# Altium schematic sheet DACs.SchDoc
size A; SheetNumber: 7; SheetTotal: 9
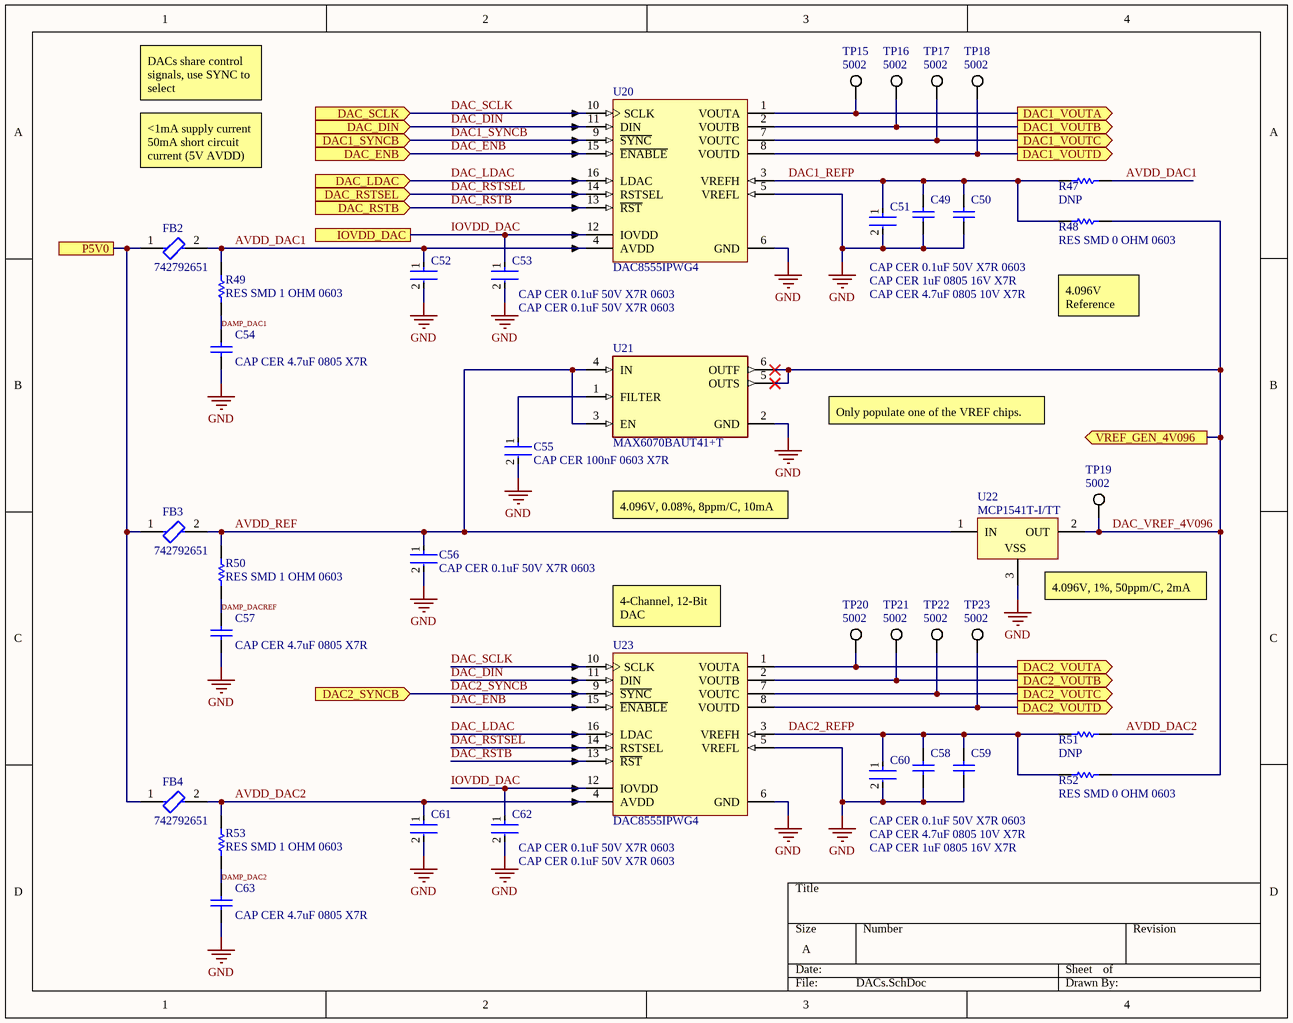
[diagram p0: DACs.SchDoc]

## Parts
C49  CAP CER 1uF 0805 16V X7R  [CAPC2013X140X50NL20T25]
C50  CAP CER 4.7uF 0805 10V X7R  [CAPC2013X140X50NL20T25]
C51  CAP CER 0.1uF 50V X7R 0603  [FP-CC0603-DA-MFG]
C52  CAP CER 0.1uF 50V X7R 0603  [FP-CC0603-DA-MFG]
C53  CAP CER 0.1uF 50V X7R 0603  [FP-CC0603-DA-MFG]
C54  CAP CER 4.7uF 0805 X7R  [CAPC2013X140X50NL20T25]
C55  CAP CER 100nF 0603 X7R  [FP-CC0603-DA-MFG]
C56  CAP CER 0.1uF 50V X7R 0603  [FP-CC0603-DA-MFG]
C57  CAP CER 4.7uF 0805 X7R  [CAPC2013X140X50NL20T25]
C58  CAP CER 1uF 0805 16V X7R  [CAPC2013X140X50NL20T25]
C59  CAP CER 4.7uF 0805 10V X7R  [CAPC2013X140X50NL20T25]
C60  CAP CER 0.1uF 50V X7R 0603  [FP-CC0603-DA-MFG]
C61  CAP CER 0.1uF 50V X7R 0603  [FP-CC0603-DA-MFG]
C62  CAP CER 0.1uF 50V X7R 0603  [FP-CC0603-DA-MFG]
C63  CAP CER 4.7uF 0805 X7R  [CAPC2013X140X50NL20T25]
FB2  742792651  [FP-742792651-MFG]
FB3  742792651  [FP-742792651-MFG]
FB4  742792651  [FP-742792651-MFG]
R47  DNP  [RESC1609X50X30LL10T20]
R48  RES SMD 0 OHM 0603  [RESC1609X50X30LL10T20]
R49  RES SMD 1 OHM 0603  [RESC1609X50X30LL10T20]
R50  RES SMD 1 OHM 0603  [RESC1609X50X30LL10T20]
R51  DNP  [RESC1609X50X30LL10T20]
R52  RES SMD 0 OHM 0603  [RESC1609X50X30LL10T20]
R53  RES SMD 1 OHM 0603  [RESC1609X50X30LL10T20]
TP15  5002  [KSTN-5002]
TP16  5002  [KSTN-5002]
TP17  5002  [KSTN-5002]
TP18  5002  [KSTN-5002]
TP19  5002  [KSTN-5002]
TP20  5002  [KSTN-5002]
TP21  5002  [KSTN-5002]
TP22  5002  [KSTN-5002]
TP23  5002  [KSTN-5002]
U20  DAC8555IPWG4  [TI-PW16_L]
U21  MAX6070BAUT41+T  [FP-U6-5-MFG]
U22  MCP1541T-I/TT  [SOT-23-TT3_L]
U23  DAC8555IPWG4  [TI-PW16_L]

## Ports
DAC1_SYNCB (in), DAC1_VOUTA (out), DAC1_VOUTB (out), DAC1_VOUTC (out), DAC1_VOUTD (out), DAC2_SYNCB (in), DAC2_VOUTA (out), DAC2_VOUTB (out), DAC2_VOUTC (out), DAC2_VOUTD (out), DAC_DIN (in), DAC_ENB (in), DAC_LDAC (in), DAC_RSTB (in), DAC_RSTSEL (in), DAC_SCLK (in), IOVDD_DAC, P5V0, VREF_GEN_4V096 (out)

## Nets
GND: C49.2 C50.2 C51.2 C52.2 C53.2 C54.2 C55.2 C56.2 C57.2 C58.2 C59.2 C60.2 C61.2 C62.2 C63.2 U20.5(VREFL) U20.6(GND) U21.2(GND) U22.3(VSS) U23.5(VREFL) U23.6(GND)
AVDD_DAC1: C52.1 FB2.2 R47.2 R49.2 U20.4(AVDD)
AVDD_DAC2: C61.1 FB4.2 R51.2 R53.2 U23.4(AVDD)
AVDD_REF: C56.1 FB3.2 R50.2 U21.3(EN) U21.4(IN) U22.1(IN)
DAC1_REFP: C49.1 C50.1 C51.1 R47.1 R48.1 U20.3(VREFH)
DAC1_SYNCB: U20.9(~{SYNC}) ; port DAC1_SYNCB
DAC1_VOUTA: TP15.1 U20.1(VOUTA) ; port DAC1_VOUTA
DAC1_VOUTB: TP16.1 U20.2(VOUTB) ; port DAC1_VOUTB
DAC1_VOUTC: TP17.1 U20.7(VOUTC) ; port DAC1_VOUTC
DAC1_VOUTD: TP18.1 U20.8(VOUTD) ; port DAC1_VOUTD
DAC2_REFP: C58.1 C59.1 C60.1 R51.1 R52.1 U23.3(VREFH)
DAC2_SYNCB: U23.9(~{SYNC}) ; port DAC2_SYNCB
DAC2_VOUTA: TP20.1 U23.1(VOUTA) ; port DAC2_VOUTA
DAC2_VOUTB: TP21.1 U23.2(VOUTB) ; port DAC2_VOUTB
DAC2_VOUTC: TP22.1 U23.7(VOUTC) ; port DAC2_VOUTC
DAC2_VOUTD: TP23.1 U23.8(VOUTD) ; port DAC2_VOUTD
DAC_DIN: U20.11(DIN) U23.11(DIN) ; port DAC_DIN
DAC_ENB: U20.15(~{ENABLE}) U23.15(~{ENABLE}) ; port DAC_ENB
DAC_LDAC: U20.16(LDAC) U23.16(LDAC) ; port DAC_LDAC
DAC_RSTB: U20.13(~{RST}) U23.13(~{RST}) ; port DAC_RSTB
DAC_RSTSEL: U20.14(RSTSEL) U23.14(RSTSEL) ; port DAC_RSTSEL
DAC_SCLK: U20.10(SCLK) U23.10(SCLK) ; port DAC_SCLK
DAC_VREF_4V096: R48.2 R52.2 TP19.1 U21.5(OUTS) U21.6(OUTF) U22.2(OUT) ; port VREF_GEN_4V096
DAMP_DAC1: C54.1 R49.1
DAMP_DAC2: C63.1 R53.1
DAMP_DACREF: C57.1 R50.1
IOVDD_DAC: C53.1 C62.1 U20.12(IOVDD) U23.12(IOVDD) ; port IOVDD_DAC
P5V0: FB2.1 FB3.1 FB4.1 ; port P5V0
NetC55_1: C55.1 U21.1(FILTER)

## Notes on the sheet
- DACs share control signals, use SYNC to select
- <1mA supply current
  50mA short circuit current (5V AVDD)
- 4.096V Reference
- Only populate one of the VREF chips.
- 4.096V, 0.08%, 8ppm/C, 10mA
- (near U23) 4-Channel, 12-Bit DAC
- (near U22) 4.096V, 1%, 50ppm/C, 2mA

## Library data of the parts
C49 C50 C54 C57-C59 C63 = CMP-2007-04677-1: Part Number: 0805ZC475KAT2A; Manufacturer: AVX Interconnect / Elco
C51-C53 C56 C60-C62 = CMP-03422-000030-1: Manufacturer Part Number: CC0603KRX7R7BB104; Manufacturer: YAGEO; Voltage Rating: 16 V; Tolerance: 0.1; Value: 100 nF; Temperature Coefficient: 15%; Material: Ceramic; Package: CC0603-DA; ComponentLink2Description: Datasheet; Octopart: https://octopart.com/cc0603krx7r7bb104-yageo-192941; Temperature Range High: +125°C; Digikey Description: CAP CER 0.1UF 16V X7R 0603; Voltage: 16 V; Device Class L2: Capacitors; Height: 0.9mm; Temperature: -55°C to +125°C; Device Class L1: Passive Components; Device Class L3: Ceramic Capacitors; ComponentLink2URL: http://www.yageo.com/documents/recent/UPY-GPHC_X7R_6.3V-to-50V_18.pdf; Footprint Url: http://www.yageo.com/exep/pages/download/literatures/UPY-C_GEN_24.pdf; RoHS: TRUE; Temperature Range Low: -55°C; Temperature Characteristic: X7R; Lead Free: Yes; Capacitance: 100 nF; Category: Cap; Mouser Description: Multilayer Ceramic Capacitor, CC Series, 0.1 - F, - 10%, X7R, 16 V, 0603 [1608 Metric]; Automotive: No
C55 = CMP-03422-000030-1: CAP CER 0.1UF 16V X7R 0603; Manufacturer Part Number: CC0603KRX7R7BB104; Manufacturer: YAGEO; Tolerance: 0.1; Temperature Coefficient: 15%; Material: Ceramic; Voltage Rating: 16 V; Package: CC0603-DA; ComponentLink2Description: Datasheet; Octopart: https://octopart.com/cc0603krx7r7bb104-yageo-192941; Temperature Range High: +125°C; Digikey Description: CAP CER 0.1UF 16V X7R 0603; Value: 100 nF; Voltage: 16 V; Device Class L2: Capacitors; Height: 0.9mm; Temperature: -55°C to +125°C; Device Class L1: Passive Components; Device Class L3: Ceramic Capacitors; ComponentLink2URL: http://www.yageo.com/documents/recent/UPY-GPHC_X7R_6.3V-to-50V_18.pdf; Footprint Url: http://www.yageo.com/exep/pages/download/literatures/UPY-C_GEN_24.pdf; RoHS: TRUE; Temperature Range Low: -55°C; Temperature Characteristic: X7R; Lead Free: Yes; Capacitance: 100 nF; Category: Cap; Mouser Description: Multilayer Ceramic Capacitor, CC Series, 0.1 - F, - 10%, X7R, 16 V, 0603 [1608 Metric]; Automotive: No
FB2-FB4 = CMP-0220-00181-2: FERRITE BEAD 600 OHM 0603 1LN; Tolerance: 25%; DC Resistance (DCR): 200mR; Inductance: 0.36H; Current Rating: 1A; Test Frequency: 100MHz; Impedance: 600R; Number of Lines: 1; Length: 1.6mm; Termination: SMD/SMT; Case Code (Metric): 1608; Case/Package: SMD/SMT; Min Operating Temperature: -55°C; Resistance: 200mR; Height: 0.8mm; Width: 0.8mm; Max Operating Temperature: 125°C; Package Quantity: 1; Mount: Surface Mount; Max DC Current: 1A; Max Current Rating: 1A; Weight: 0.000141oz; Packaging: Tape and Reel; Lead Free: Lead Free; Case Code (Imperial): 0603; Series: WE-CBF; Core Material: Ferrite; Material: Ferrite; RoHS Compliant: Yes; Depth: 0.8mm
R47-R53 = CMP-2000-03820-1: Part Number: CRCW0603100KFKEA; Manufacturer: Vishay Dale
TP15-TP23 = CMP-2000-05182-1: Test Point, White, 1-Pin THD, RoHS, Bulk; Manufacturer: KeystoneElectronics; Outside Diameter: 2.54mm; Plating: Silver; Mounting Hole Size: 1mm; Product: TestPoints; Packaging: Bulk; Manufacturer URL: http://www.keyelco.com/; Length: 7.62mm; Datasheet Version: Rev. G, 12/2008; Type: Miniature; Product Category: CircuitBoardHardware-PCB; Material: Nylon; RoHS: True; Contact Material: PhosphorBronze; Datasheet URL: https://ciiva.com/datasheet-click-2917627?src=ciiva&sig=bd195616; Color: White; Brand: KeystoneElectronics
U20 U23 = CMP-0004-01174-1: 16-Bit, Quad Channel, Ultralow Glitch, Voltage Output Digital to Analog Converter, -40 to 105 degC, 16-pin SOP (PW16), Green (RoHS & no Sb/Br); Manufacturer: Texas Instruments; SubFamily: Precision DAC (=<10MSPS); Resolution(Bits): 16; SNR(dB): 95; Interface: Serial SPI; SFDR(dB): 87; DAC Channels: 4; Settling Time(us): 10; DNL(Max)(+/-LSB): 1; ComponentLink2Description: Datasheet; PackageReference: PW16; PackageVersion: 4040064-4/G, 02/2011; ComponentLink3Description: Package Specification; Code_JEDEC: MO-153; Eco-Plan: Green (RoHS & no Sb/Br); Mounting Technology: Surface Mount; DatasheetVersion: SLAS475B; PackageDescription: 16-Pin Plastic Small Outline, Body 5 x 4.4 mm, Pitch 0.65 mm; ComponentLink1Description: Manufacturer URL; ComponentLink1URL: http://www.ti.com/; ComponentLink3URL: http://www.ti.com/lit/ml/mpds361/mpds361.pdf; PartNumber: DAC8555IPWG4; ComponentLink2URL: http://www.ti.com/general/docs/lit/getliterature.tsp?genericPartNumber=DAC8555&fileType=pdf
U21 = CMP-05720-000007-1: IC VREF SERIES 0.04% SOT23-6; Output Current: 10mA; Max Input Voltage: 5.5V; Operating Supply Current: 300uA; Output Voltage: 3V; Number of Channels: 1; Quiescent Current: 235uA; Output Type: Fixed; Temperature Coefficient: 6ppm/°C; Min Input Voltage: 2.7V; Number of Pins: 6; Max Operating Temperature: 125°C; Packaging: Tape and Reel; Min Output Voltage: 3V; Case/Package: SOT-23-6; Tolerance: 0.04%; Reference Voltage: 3V; Min Operating Temperature: -40°C; Mount: Surface Mount; Package Quantity: 2500; Reference Type: Series
U22 = CMP-0131-00004-1: 4.096V Voltage Reference, 3-Pin SOT-23, Industrial Temperature, Tape and Reel; Code_IPC: SOT23-3; DatasheetVersion: revB, Feb-2005; PackageReference: SOT-23-TT3; PackageDescription: 3-Lead Plastic Small Outline Transistor (TT) [SOT-23]; PackageVersion: revBB, Aug-2009